# EAGLE design controller-main (EAGLE 8.4.1)
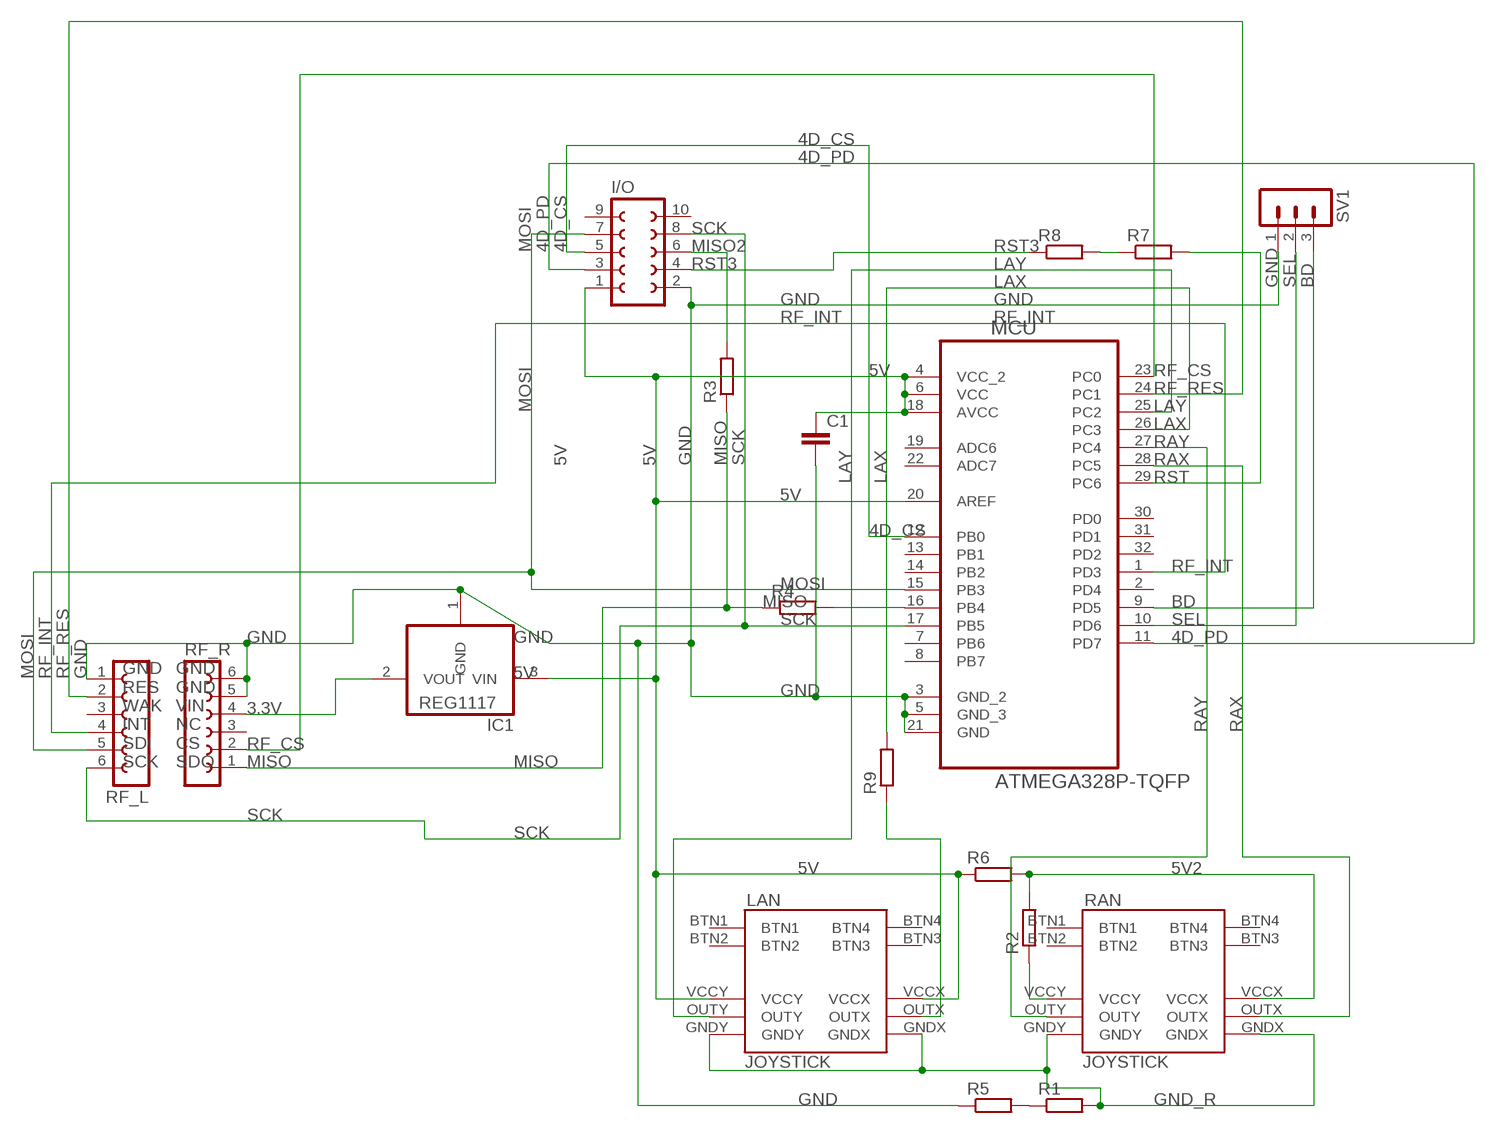
[diagram p0: schematic, sheet 1]

## Parts
C1  C-EUC1206  [C1206]
I/O  FE05-2W  [FE05-2W]
IC1  REG1117  [SOT223]
LAN  JOYSTICK  JOYSTICKJOYSTICKWBTN  [JOYSTICK]
MCU  ATMEGA328P-TQFP  ATMEGA328P-AU  [QFP80P900X900X120-32N]
R1  R-EU_M1206  [M1206]
R2  R-EU_M1206  [M1206]
R3  R-EU_M1206  [M1206]
R4  R-EU_M1206  [M1206]
R5  R-EU_M1206  [M1206]
R6  R-EU_M1206  [M1206]
R7  R-EU_M1206  [M1206]
R8  R-EU_M1206  [M1206]
R9  R-EU_M1206  [M1206]
RAN  JOYSTICK  JOYSTICKJOYSTICKWBTN  [JOYSTICK]
RF_L  FE06-1  [FE06]
RF_R  FE06-1  [FE06]
SV1  MA03-1  [MA03-1]

## Nets
3.3V: IC1.2(VOUT) RF_R.4
4D_CS: I/O.5 MCU.12(PB0)
4D_PD: I/O.3 MCU.11(PD7)
5V: C1.1 I/O.1 IC1.3(VIN) LAN.VCCX LAN.VCCY MCU.4(VCC_2) MCU.6(VCC) MCU.18(AVCC) MCU.20(AREF) R6.1
5V2: R2.2 R6.2 RAN.VCCX
5V_R: R2.1 RAN.VCCY
BD: MCU.9(PD5) SV1.3
GND: C1.2 I/O.2 IC1.1(GND) MCU.3(GND_2) MCU.5(GND_3) MCU.21(GND) R5.1 RF_L.1 RF_R.5 RF_R.6 SV1.1
GND_R: LAN.GNDX LAN.GNDY R1.2 RAN.GNDX RAN.GNDY
LAX: MCU.26(PC3) R9.2
LAY: LAN.OUTY MCU.25(PC2)
MISO: R3.1 R4.1 RF_R.1
MISO2: I/O.6 R3.2
MISO3: MCU.16(PB4) R4.2
MOSI: I/O.7 MCU.15(PB3) RF_L.5
N$1: R1.1 R5.2
N$2: LAN.OUTX R9.1
RAX: MCU.28(PC5) RAN.OUTX
RAY: MCU.27(PC4) RAN.OUTY
RF_CS: MCU.23(PC0) RF_R.2
RF_INT: MCU.1(PD3) RF_L.4
RF_RES: MCU.24(PC1) RF_L.2
RST: MCU.29(PC6) R7.2
RST2: R7.1 R8.2
RST3: I/O.4 R8.1
SCK: I/O.8 MCU.17(PB5) RF_L.6
SEL: MCU.10(PD6) SV1.2
Unconnected: I/O.9 I/O.10 LAN.BTN1 LAN.BTN2 LAN.BTN3 LAN.BTN4 MCU.2(PD4) MCU.7(PB6) MCU.8(PB7) MCU.13(PB1) MCU.14(PB2) MCU.19(ADC6) MCU.22(ADC7) MCU.30(PD0) MCU.31(PD1) MCU.32(PD2) RAN.BTN1 RAN.BTN2 RAN.BTN3 RAN.BTN4 RF_L.3 RF_R.3

## Notes on the sheet
- GND
  RES
  WAK
  INT
  SDI
  SCK
- GND
  GND
  VIN
  NC
  CS
  SDO

## Library data of the parts
C1 = resistor:C-EU: CAPACITOR, European symbol
I/O = con-lsta:FE05-2W: FEMALE HEADER; OC_FARNELL: unknown; OC_NEWARK: unknown
IC1 = burr-brown:REG1117: 800mA and 1A Low Dropout (LDO) Positive Regulator 1.8V, 2.5V, 2.85V, 3.3V, 5V, and Adj; MPN: REG1117; OC_FARNELL: 1097566; OC_NEWARK: 14P6981
LAN RAN = joystick:JOYSTICK
MCU = Atmel_By_element14_Batch_1-00:ATMEGA328P-AU: 8-bit Microcontroller with In-System Programmable Flash; MPN: ATMEGA328P-AU; OC_FARNELL: 1715486; OC_NEWARK: 14R4631; PACKAGE: TQFP-32; SUPPLIER: Atmel
R1-R9 = resistor:R-EU_: RESISTOR, European symbol
RF_L RF_R = con-lsta:FE06-1: FEMALE HEADER; OC_FARNELL: unknown; OC_NEWARK: unknown
SV1 = con-lstb:MA03-1: PIN HEADER; OC_FARNELL: unknown; OC_NEWARK: unknown

## Board
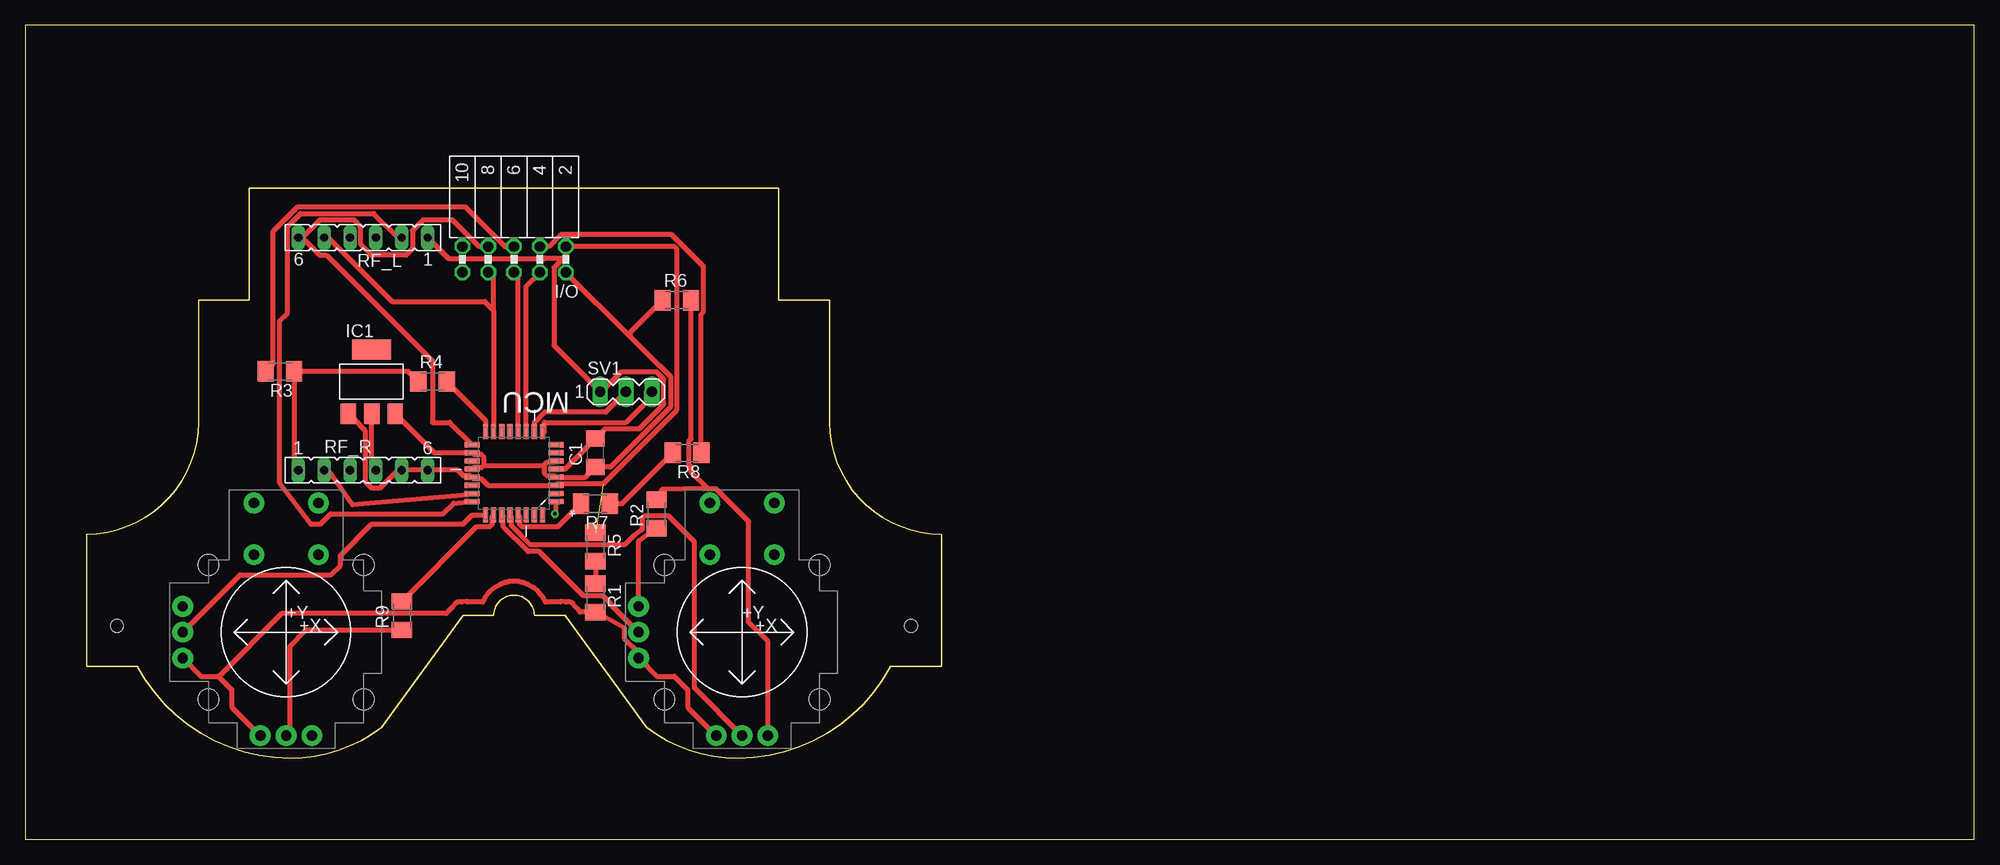
[diagram p1: board, top side]
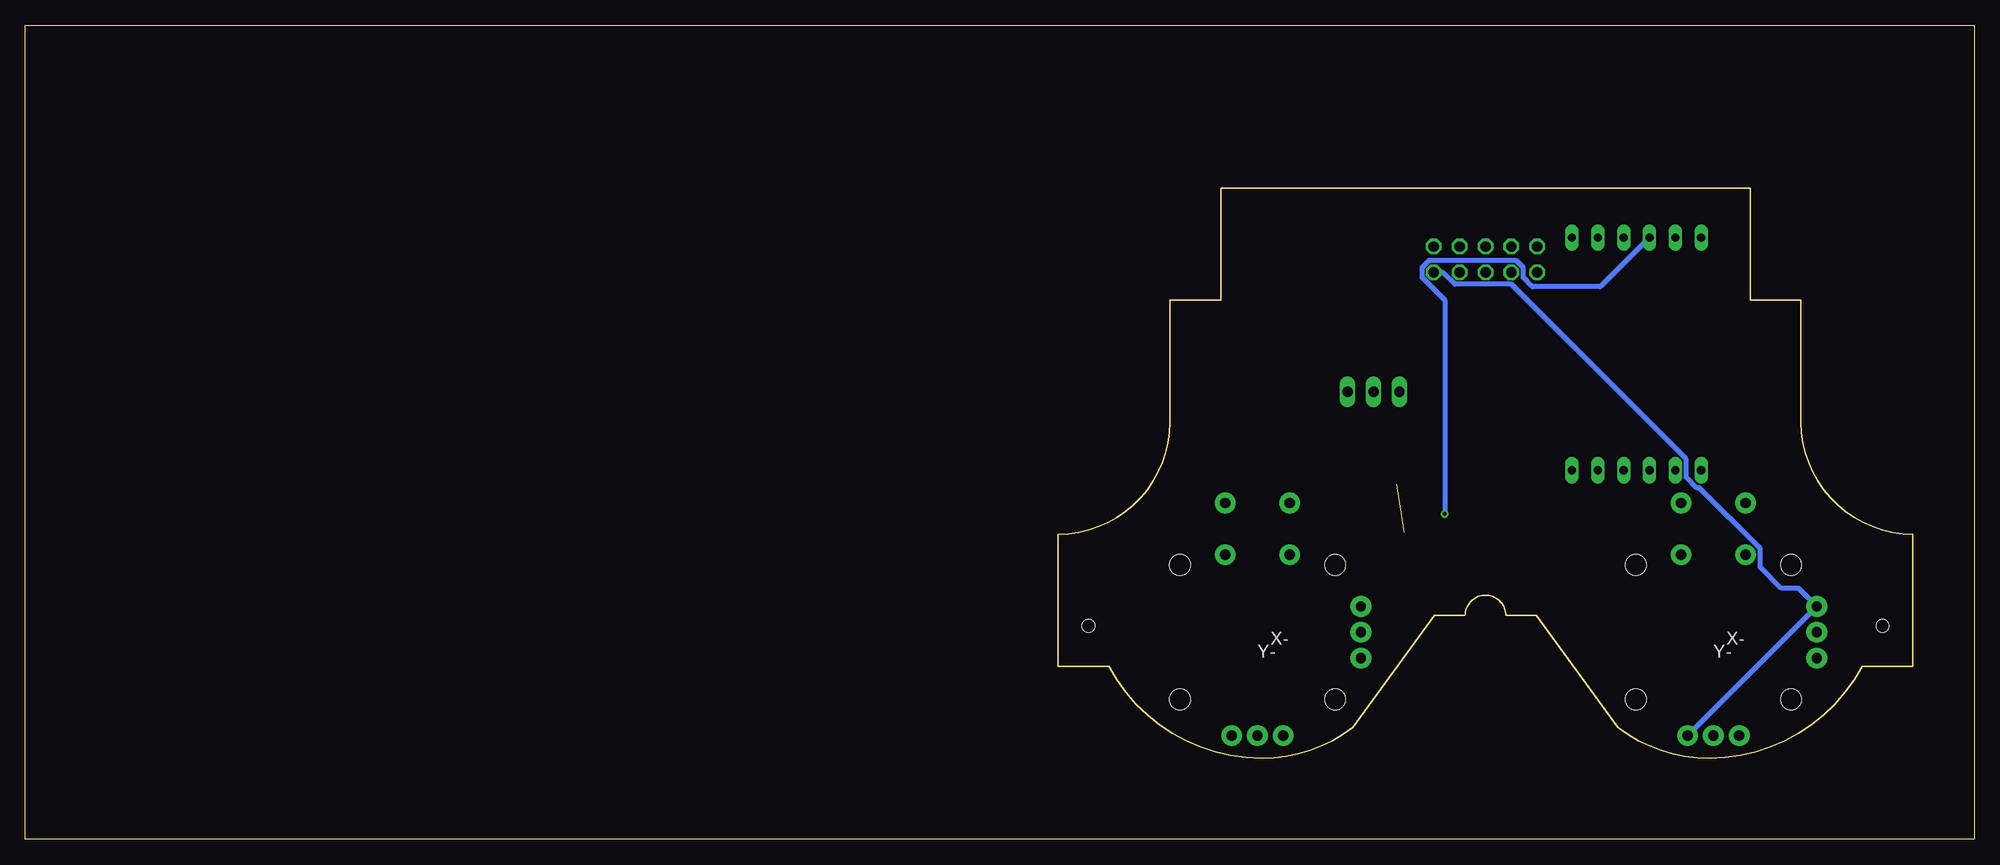
[diagram p2: board, bottom side, seen from below]

Size 191.44 x 80 mm. Coordinates in mm from the lower left corner, seen from the top.
Outline: 0,0 191.44,0 191.44,80 0,80 0,0
Outline: 22,64 74,64 74,53 79,53 79,41 arc90 90,30 90,17 85,17 arc-62 70,8 arc-37 61,11 53,22 50,22 arc90 48,24 arc90 46,22 43,22 35,11 arc-37 26,8 arc-62 11,17 6,17 6,30 arc90 17,41 17,53 22,53 22,64
Copper layers (1*16): Top 0.035mm / dielectric 1.5mm / Bottom 0.035mm
Design rules "default": minimum track width 6mil, minimum drill 0.35mm, track to track 6mil, track to pad 6mil, pad to pad 6mil, via to via 6mil, smd to smd 6mil, copper to edge 40mil, drill to drill 6mil, minimum pad ring 10mil, minimum via ring 8mil, stop-mask expansion 4mil, vias tented up to drill 0mil, thermal gap 10mil
Holes 1.25 mm at 9,21 87,21

### Footprints (pad centres in the part's own frame; a part is rotated, then mirrored left to right if it is on the bottom)
C1206 = smd 1.6 x 1.8: 1 -1.4,0; 2 1.4,0
FE05-2W = drill 1.016 octagon: 1 -5.08,1.27; 2 -5.08,-1.27; 3 -2.54,1.27; 4 -2.54,-1.27; 5 0,1.27; 6 0,-1.27; 7 2.54,1.27; 8 2.54,-1.27; 9 5.08,1.27; 10 5.08,-1.27
SOT223 = smd 1.499 x 2.007: 1 -2.261,-3.15; 2 0.025,-3.15; 3 2.311,-3.15 | smd 3.81 x 2.007: 4 0,3.15
JOYSTICK = drill 1.016 pad 2.032: BTN1 -3.175,12.7; BTN2 -3.175,7.62; BTN3 3.175,7.62; BTN4 3.175,12.7; GNDX -2.54,-10.16; GNDY -10.16,-2.54; OUTX 0,-10.16; OUTY -10.16,0; VCCX 2.54,-10.16; VCCY -10.16,2.54 | hole 2.032: -7.62,6.604; -7.62,-6.604; 7.62,6.604; 7.62,-6.604
QFP80P900X900X120-32N = smd 1.473 x 0.508: 1 -4.115,2.794; 2 -4.115,2.007; 3 -4.115,1.194; 4 -4.115,0.406; 5 -4.115,-0.406; 6 -4.115,-1.194; 7 -4.115,-2.007; 8 -4.115,-2.794; 17 4.115,-2.794; 18 4.115,-2.007; 19 4.115,-1.194; 20 4.115,-0.406; 21 4.115,0.406; 22 4.115,1.194; 23 4.115,2.007; 24 4.115,2.794 | smd 0.508 x 1.473: 9 -2.794,-4.115; 10 -2.007,-4.115; 11 -1.194,-4.115; 12 -0.406,-4.115; 13 0.406,-4.115; 14 1.194,-4.115; 15 2.007,-4.115; 16 2.794,-4.115; 25 2.794,4.115; 26 2.007,4.115; 27 1.194,4.115; 28 0.406,4.115; 29 -0.406,4.115; 30 -1.194,4.115; 31 -2.007,4.115; 32 -2.794,4.115
M1206 = smd 1.6 x 2: 1 -1.4,0; 2 1.4,0
FE06 = drill 0.813 long: 1 -6.35,0; 2 -3.81,0; 3 -1.27,0; 4 1.27,0; 5 3.81,0; 6 6.35,0
MA03-1 = drill 1.016 long: 1 -2.54,0; 2 0,0; 3 2.54,0

### Placement (x,y rotation side)
C1  56,38 90 top
I/O  48,57 180 top
IC1  34,45 0 top
LAN  25.61,20.37 0 top
MCU  48,36 180 top
R1  56,23.75 270 top
R2  62,32 90 top
R3  25,46 180 top
R4  40,45 0 top
R5  56,28.75 270 top
R6  64,53 0 top
R7  56,33 180 top
R8  65,38 180 top
R9  37,22 90 top
RAN  70.4,20.37 0 top
RF_L  33.16,59.15 180 top
RF_R  33.16,36.29 0 top
SV1  59,44 0 top

### Tracks (layer width: path | path; a pad name or v marks a point on that pad's centre or on a via)
3.3V
  Top 0.5: RF_R.4 34.02,36.7 IC1.2
4D_CS
  Top 0.5: MCU.12 48.41,55.32 I/O.5
4D_PD
  Top 0.5: MCU.11 49.19,54.38 I/O.3
5V
  Top 0.5: IC1.3 40.16,38.01 MCU.18 44.04,37.85 44.79,37.85 45.02,37.61 45.02,36.77 | 50.98,36.83 51.21,37.06 51.98,37.06 MCU.6 | 50.98,36.83 50.98,35.99 51.21,35.75 51.96,35.75 MCU.4 54.99,35.59 C1.1 57.47,36.6 63.36,42.48 63.36,45.52 62.29,46.58 62.23,46.58 59.41,49.41 | 45.02,36.77 44.79,36.54 44.02,36.54 MCU.20 | 45.02,36.77 50.92,36.77 50.98,36.83 | 59.41,49.41 I/O.1 | R6.1 59.41,49.8 59.41,49.41
  Bottom 0.5: LAN.VCCX LAN.VCCY 17.23,24.69 18.93,24.69 21.02,26.77 21.02,28.58 27.01,34.57 27.25,34.57 28.29,35.6 28.29,37.39 45.46,54.57 51.02,54.57 52.19,55.73 I/O.1
5V2
  Top 0.5: RAN.VCCX 72.94,19.46 71.05,21.35 71.05,31.25 67.81,34.49 67,34.49 | 67,34.49 66.64,34.49 62.55,34.4 R2.2 | 67,34.49 65.4,36.09 65.4,36.63 65.2,36.83 65.2,39.17 65.4,39.37 R6.2
5V_R
  Top 0.5: RAN.VCCY 60.24,29.36 R2.1
BD
  Top 0.5: SV1.3 61,44 61,43 59,41 51,41 51,40 MCU.9
GND  (1 unrouted)
  Top 0.5: IC1.1 32.87,40.72 32.87,40.68 33.37,40.19 33.37,35.19 33.99,34.57 34.87,34.57 36.59,36.29 RF_R.5 RF_R.6 42.44,36.29 42.98,35.75 43.73,35.75 MCU.21 44.02,35.46 44.79,35.46 45.45,34.81 MCU.3 52.25,34.94 56.73,34.94 64.01,42.22 64.01,46 | MCU.5 53.01,36.41 C1.2 56.95,40.35 60.3,40.35 62.7,42.76 62.7,45.24 62.02,45.93 58.52,45.93 56.59,44 SV1.1 51.92,48.54 51.92,56.21 52.85,57.15 | 64.01,46 64.01,46.45 | 52.85,57.15 53.08,57.38 I/O.2 63.73,58.27 64,58 64,46.01 64.01,46 | 52.85,57.15 51.06,57.15 51.02,57.11 41.55,57.11 RF_L.1
GND_R
  Top 0.5: RAN.GNDX 65.06,13.01 65.06,14.71 63.73,16.05 62.02,16.05 RAN.GNDY 60.24,18.36 58.82,19.78 58.82,20.78 R1.2 54.49,22.35 54.34,22.56 54.02,22.88 53.76,23.24 53.64,23.26 53.56,23.34 53.1,23.34 52.66,23.41 52.56,23.34 51.07,23.34 51.04,23.42 50.75,23.92 50.37,24.37 49.92,24.75 49.42,25.04 48.87,25.24 48.61,25.29 48.56,25.34 47.44,25.34 47.39,25.29 47.13,25.24 46.58,25.04 46.08,24.75 45.63,24.37 45.25,23.92 44.96,23.42 44.93,23.34 43.44,23.34 43.34,23.41 42.9,23.34 42.44,23.34 42.36,23.26 42.24,23.24 41.98,22.88 41.51,22.4 41.36,22.2 25.2,22.2 18.99,15.99 | LAN.GNDY 17.23,16.05 18.93,16.05 18.99,15.99 | 18.99,15.99 20.27,14.71 20.27,13.01 LAN.GNDX
LAX
  Top 0.5: R9.2 44.35,30.75 45.63,30.75 45.86,30.98 45.86,31.75 MCU.26
LAY
  Top 0.5: LAN.OUTY 21.08,26 30,26 30.95,26.95 30.95,27.92 34.03,31 43,31 43.88,31.89 MCU.25
MISO
  Top 0.5: RF_R.1 26.4,36.7 R3.1 37.6,46 R4.1
MISO2
  Top 0.5: R3.2 24.35,46.75 24.35,59.77 26.75,62.18 43.2,62.18 47.11,58.27 I/O.6
MISO3
  Top 0.5: R4.2 45.21,41.19 MCU.16
MOSI
  Top 0.5: 45.99,52 45.99,55.2 I/O.7 | 45.99,52 MCU.15 | RF_L.5 29.73,59.15 36.01,52.87 45.13,52.87 45.99,52
N$1
  Top 0.5: R5.2 R1.1
N$2
  Top 0.5: LAN.OUTX 26,10.6 26,19 27.6,20.6 R9.1
RAX
  Top 0.5: RAN.OUTX 65.71,14.9 65.71,29.25 63.17,31.8 60.83,31.8 60.6,31.57 60.6,30.45 59.97,30.01 59.82,29.86 59.64,29.74 58.85,28.95 49.65,28.95 47.75,30.85 47.75,31.73 MCU.28
RAY
  Top 0.5: RAN.OUTY 57.4,23.21 57.4,23.32 56.77,23.95 54.83,23.95 50.49,28.3 49.38,28.3 46.94,30.74 46.94,31.75 MCU.27
RF_CS
  Top 0.5: RF_R.2 29.73,36.29 32.1,32.91 43.49,33.91 43.57,33.99 MCU.23
RF_INT  (via drill 0.35)
  Top 0.5: v52,32 52.12,32.12 MCU.1
  Bottom 0.5: RF_L.4 36.72,54.32 43.37,54.32 44.3,55.25 44.3,56.21 44.98,56.89 53.56,56.89 54.24,56.21 54.24,55.25 52,53 v52,32
RF_RES
  Top 0.5: RF_L.2 36.59,59.15 34.22,61.53 27.02,61.53 25.75,60.25 25.75,51.75 25,51 25,35 28,31 29,31 30,32 41,32 42.04,33.04 MCU.24
RST
  Top 0.5: MCU.29 48.54,31.75 48.54,30.98 48.77,30.75 52.35,30.75 R7.2
RST2
  Top 0.5: R7.1 58.6,33 R8.2
RST3
  Top 0.5: I/O.4 51.43,58.27 52.6,59.43 63.49,59.43 66.6,56.32 66.6,51.83 66.4,51.63 R8.1
SCK
  Top 0.5: I/O.8 44.57,58.27 41.96,60.87 39.07,60.87 38.03,59.84 38.03,58.05 37.41,57.43 33.99,57.43 32.95,58.46 32.95,60.25 32.33,60.87 28.91,60.87 27.19,59.15 | 27.19,59.15 RF_L.6 27.19,59.15 | 27.19,59.15 28.91,57.43 29.57,57.43 40,47 40,41 41.68,41 MCU.17
SEL
  Top 0.5: SV1.2 57,42 51,42 50,41 50,40 MCU.10